# EAGLE design ESP-XBee_v1.0 (EAGLE 7.5.0)
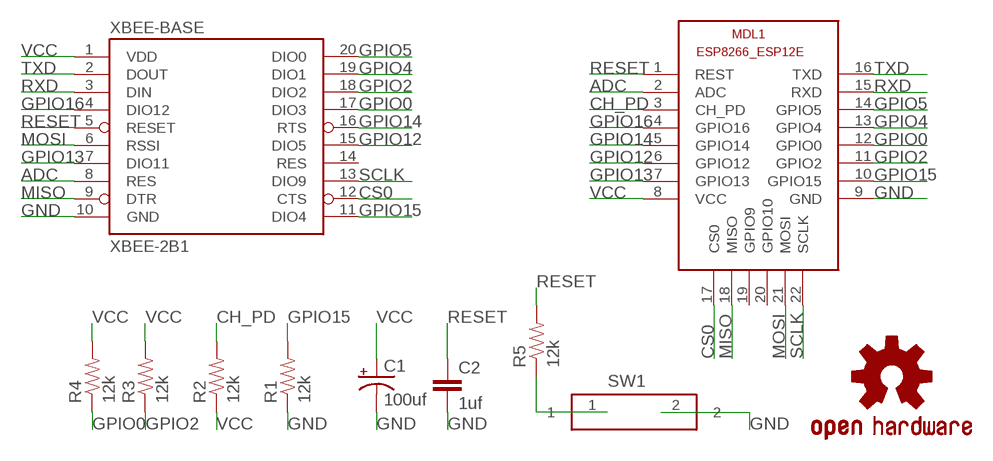
[diagram p0: schematic, sheet 1]

## Parts
C1  100uf  CAP_POL1206-KIT  [EIA3216-KIT]
C2  1uf  CAP0805  [0805]
LOGO3  OSHW-LOGOS  [OSHW-LOGO-S]
MDL1  ESP8266-12EESP8266-ESP12E  [ESP8266-ESP12E]
R1  12k  RESISTOR0805-RES  [0805]
R2  12k  RESISTOR0805-RES  [0805]
R3  12k  RESISTOR0805-RES  [0805]
R4  12k  RESISTOR0805-RES  [0805]
R5  12k  RESISTOR0805-RES  [0805]
SW1  434111043826  [434111043826]
XBEE-BASE  XBEE-2B1  [XBEE-1]

## Nets
ADC: MDL1.2(ADC) XBEE-BASE.8(RES)
CH_PD: MDL1.3(CH_PD) R2.2
CS0: MDL1.17(CS0) XBEE-BASE.12(CTS)
GND: C1.C(-) C2.2 MDL1.9(GND) R1.1 SW1.2 XBEE-BASE.10(GND)
GPIO0: MDL1.12(GPIO0) R4.1 XBEE-BASE.17(DIO3)
GPIO2: MDL1.11(GPIO2) R3.1 XBEE-BASE.18(DIO2)
GPIO4: MDL1.13(GPIO4) XBEE-BASE.19(DIO1)
GPIO5: MDL1.14(GPIO5) XBEE-BASE.20(DIO0)
GPIO12: MDL1.6(GPIO12) XBEE-BASE.15(DIO5)
GPIO13: MDL1.7(GPIO13) XBEE-BASE.7(DIO11)
GPIO14: MDL1.5(GPIO14) XBEE-BASE.16(RTS)
GPIO15: MDL1.10(GPIO15) R1.2 XBEE-BASE.11(DIO4)
GPIO16: MDL1.4(GPIO16) XBEE-BASE.4(DIO12)
MISO: MDL1.18(MISO) XBEE-BASE.9(DTR)
MOSI: MDL1.21(MOSI) XBEE-BASE.6(RSSI)
N$1: R5.1 SW1.1
RESET: C2.1 MDL1.1(REST) R5.2 XBEE-BASE.5(RESET)
RXD: MDL1.15(RXD) XBEE-BASE.3(DIN)
SCLK: MDL1.22(SCLK) XBEE-BASE.13(DIO9)
TXD: MDL1.16(TXD) XBEE-BASE.2(DOUT)
VCC: C1.A(+) MDL1.8(VCC) R2.1 R3.2 R4.2 XBEE-BASE.1(VDD)
Unconnected: MDL1.19(GPIO9) MDL1.20(GPIO10) XBEE-BASE.14(RES)

## Library data of the parts
C1 = SparkFun-Capacitors:CAP_POL: Capacitor Polarized These are standard SMD and PTH capacitors. Normally 10uF, 47uF, and 100uF in electrolytic and tantalum varieties. Always verify the external diameter of the through hole cap, it varies with capacity, voltage, and manufacturer. The EIA devices should be standard.
C2 = SparkFun-Capacitors:CAP: Capacitor Standard 0603 ceramic capacitor, and 0.1" leaded capacitor.
LOGO3 = SparkFun-Aesthetics:OSHW-LOGO: Open Source Hardware Logo This logo indicates the piece of hardware it is found on incorporates a OSHW license and/or adheres to the definition of open source hardware found here: http://freedomdefined.org/OSHW
MDL1 = ESP8266-ESP12E:ESP8266-12E: ESP8266-12E with additional I/O and GPIO04/05 corrected The author cannot warrant that this library is free from error or will meet your specific requirements. Created by PuceBaboon.com. Komagane, Nagano, JAPAN
R1-R5 = SparkFun-Passives:RESISTOR: Resistor Basic schematic elements and footprints for 0603, 1206, and PTH resistors.
SW1 = Switches_rev16a:434111043826: WS-TRS-6x3.5 mm SMD Tact Switch, 2 pins
XBEE-BASE = SparkFun-RF:XBEE-2: Xbee module footprints SMT header is CONN-09042.

## Board
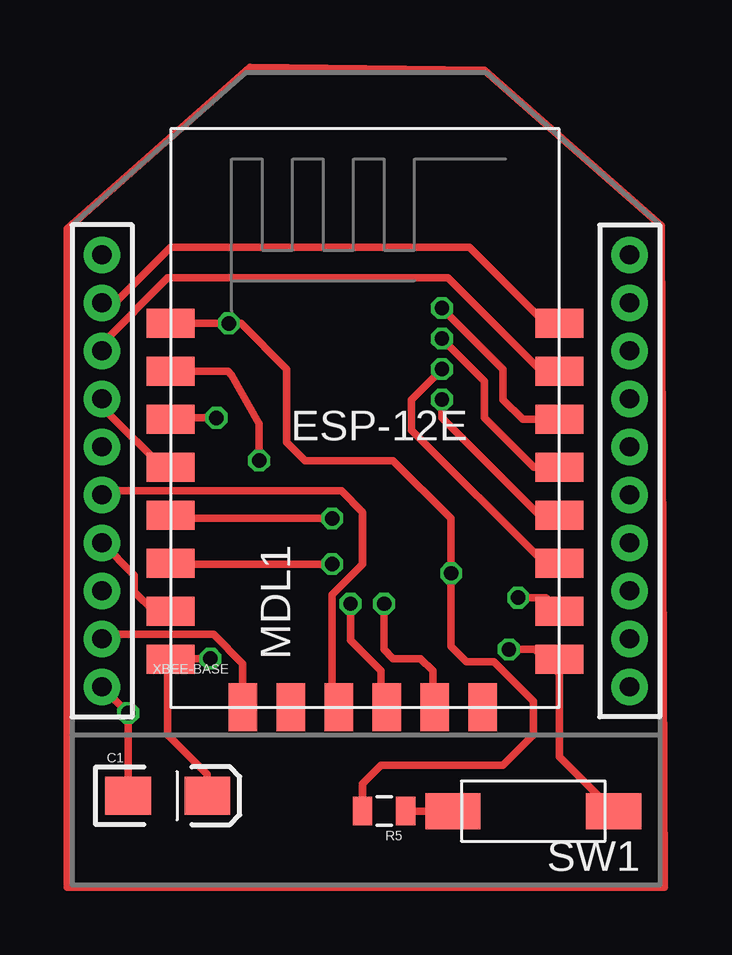
[diagram p1: board, top side]
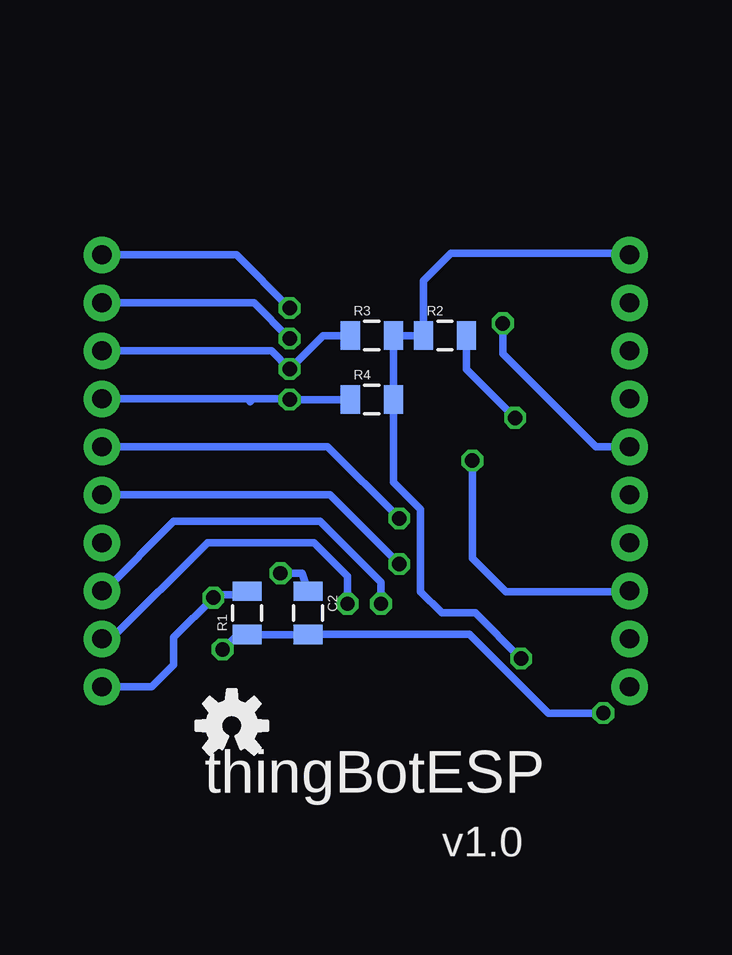
[diagram p2: board, bottom side, seen from below]

No outline drawn. Coordinates in mm, seen from the top.
Copper layers (1*16): Top 0.035mm / dielectric 1.5mm / Bottom 0.035mm
Design rules "SeeedStudio_2layer_DRU_no_angle_20140221": minimum track width 6mil, minimum drill 12mil, track to track 6mil, track to pad 6mil, pad to pad 6mil, via to via 6mil, smd to smd 0mil, copper to edge 10mil, drill to drill 10mil, minimum pad ring 10mil, minimum via ring 6mil, stop-mask expansion 2mil, vias tented up to drill 100mil, thermal gap 10mil

### Footprints (pad centres in the part's own frame; a part is rotated, then mirrored left to right if it is on the bottom)
EIA3216-KIT = smd 1.9 x 1.6: A 1.65,0; C -1.65,0
0805 = smd 0.8 x 1.2: 1 -0.9,0; 2 0.9,0
ESP8266-ESP12E = smd 2 x 1.2: 1 0,16; 2 0,14; 3 0,12; 4 0,10; 5 0,8; 6 0,6; 7 0,4; 8 0,2; 9 16.2,2; 10 16.2,4; 11 16.2,6; 12 16.2,8; 13 16.2,10; 14 16.2,12; 15 16.2,14; 16 16.2,16 | smd 1.2 x 2: 17 11,0; 18 3,0; 19 5,0; 20 13,0; 21 7,0; 22 9,0
434111043826 = smd 2.3 x 1.5: 1 -3.35,0; 2 3.35,0
XBEE-1 = drill 0.8 pad 1.524: 1 -11,20; 2 -11,18; 3 -11,16; 4 -11,14; 5 -11,12; 6 -11,10; 7 -11,8; 8 -11,6; 9 -11,4; 10 -11,2; 11 11,2; 12 11,4; 13 11,6; 14 11,8; 15 11,10; 16 11,12; 17 11,14; 18 11,16; 19 11,18; 20 11,20

### Placement (x,y rotation side)
C1  34.29,22.86 0 top
C2  44.96,30.48 270 bottom
LOGO3  48.13,25.78 0 bottom
MDL1  34.42,26.54 0 top
R1  47.5,30.48 90 bottom
R2  39.24,42.04 0 bottom
R3  42.29,42.04 0 bottom
R4  42.29,39.37 0 bottom
R5  43.31,22.23 180 top
SW1  49.53,22.23 0 top
XBEE-BASE  42.55,25.4 0 top

### Tracks (layer width: path | path; a pad name or v marks a point on that pad's centre or on a via)
ADC  (via drill 0.6)
  Top 0.305: MDL1.2 36.8,40.54 36.96,40.39 38.1,38.35 v38.1,36.83
  Bottom 0.305: v38.1,36.83 38.1,32.77 36.7,31.37 31.58,31.37 XBEE-BASE.8
CH_PD  (via drill 0.6)
  Top 0.305: v36.32,38.61 34.48,38.61 MDL1.3
  Bottom 0.305: R2.2 38.34,40.63 v36.32,38.61
CS0  (via drill 0.6)
  Top 0.305: v43.31,30.86 43.31,28.96 43.69,28.57 44.83,28.57 45.34,28.07 45.34,26.62 MDL1.17
  Bottom 0.305: XBEE-BASE.12 53.15,29.4 49.15,33.4 44.7,33.4 43.31,32 v43.31,30.86
GND  (via drill 0.6)
  Top 0.305: MDL1.9 50.62,27.94 | 50.62,27.94 50.62,24.49 SW1.2 | C1.C v32.64,26.3 XBEE-BASE.10 | v48.51,28.96 49.6,28.96 50.62,27.94
  Bottom 0.305: v32.64,26.3 34.94,26.3 38.23,29.59 44.44,29.59 C2.2 R1.1 47.89,29.58 v48.51,28.96
GPIO0  (via drill 0.6)
  Top 0.305: MDL1.12 49.78,34.54 45.72,38.61 v45.72,39.37
  Bottom 0.305: XBEE-BASE.17 47.24,39.4 | 47.24,39.4 45.75,39.4 v45.72,39.37 R4.1 | 47.37,39.27 47.24,39.4
GPIO2  (via drill 0.6)
  Top 0.305: MDL1.11 50.01,32.54 44.45,38.1 44.45,39.37 v45.72,40.64
  Bottom 0.305: XBEE-BASE.18 46.48,41.4 v45.72,40.64 44.32,42.04 R3.1
GPIO4  (via drill 0.6)
  Top 0.305: MDL1.13 49.56,36.54 47.5,38.61 47.5,40.13 v45.72,41.91
  Bottom 0.305: XBEE-BASE.19 47.21,43.4 v45.72,41.91
GPIO5  (via drill 0.6)
  Top 0.305: MDL1.14 49.09,38.54 48.26,39.37 48.26,40.64 v45.72,43.18
  Bottom 0.305: XBEE-BASE.20 47.94,45.4 v45.72,43.18
GPIO12  (via drill 0.6)
  Top 0.305: v41.15,32.51 34.45,32.51 MDL1.6
  Bottom 0.305: XBEE-BASE.15 44.04,35.4 v41.15,32.51
GPIO13
  Top 0.305: MDL1.7 33.72,30.54 32.89,31.37 32.89,32.05 XBEE-BASE.7
GPIO14  (via drill 0.6)
  Top 0.305: v41.15,34.42 34.54,34.42 MDL1.5
  Bottom 0.305: XBEE-BASE.16 44.13,37.4 v41.15,34.42
GPIO15  (via drill 0.6)
  Top 0.305: v48.9,31.11 50.05,31.11 MDL1.10
  Bottom 0.305: R1.2 47.64,31.24 48.77,31.24 v48.9,31.11 50.55,29.46 50.55,28.32 51.47,27.4 XBEE-BASE.11
GPIO16
  Top 0.305: MDL1.4 34.07,36.54 31.88,38.73 31.88,39.07 XBEE-BASE.4
MISO
  Top 0.305: MDL1.18 37.42,28.37 36.2,29.59 31.74,29.59 XBEE-BASE.9
MOSI
  Top 0.305: XBEE-BASE.6 31.59,35.4 31.75,35.56 41.53,35.56 42.42,34.67 42.42,32.51 41.15,31.24 41.15,26.81 MDL1.21
N$1
  Top 0.305: SW1.1 R5.1
N$2
  Top 0.305: 30.1,19.18 30.1,46.48 37.72,53.21 47.5,53.09 54.86,46.61 54.99,19.05 30.61,19.05 30.48,19.05 30.1,19.05
RESET  (via drill 0.6)
  Top 0.305: R5.2 42.41,23.36 43.18,24.13 48.26,24.13 49.53,25.4 49.53,26.8 47.88,28.45 46.74,28.45 46.1,29.08 v46.1,32.13 46.1,34.42 43.69,36.83 40.01,36.83 39.24,37.59 39.24,40.64 37.34,42.55 v36.83,42.55 MDL1.1 34.54,42.42
  Bottom 0.305: v46.1,32.13 45.2,32.13 C2.1 | XBEE-BASE.5 32.95,37.4 36.83,41.27 v36.83,42.55
RXD
  Top 0.305: XBEE-BASE.3 31.55,41.7 34.29,44.45 45.97,44.45 49.91,40.51 50.59,40.51 MDL1.15
SCLK  (via drill 0.6)
  Top 0.305: MDL1.22 43.18,26.78 43.18,28.07 41.91,29.34 v41.91,30.86
  Bottom 0.305: XBEE-BASE.13 53.44,31.4 50.55,34.29 44.45,34.29 41.91,31.75 v41.91,30.86
TXD
  Top 0.305: XBEE-BASE.2 32.1,43.4 34.42,45.72 46.86,45.72 50.04,42.55 MDL1.16
VCC  (via drill 0.6)
  Top 0.305: C1.A 35.94,23.75 34.29,25.4 34.29,28.42 MDL1.8 34.45,28.57 v36.07,28.57
  Bottom 0.305: XBEE-BASE.1 31.61,45.47 38.99,45.47 40.14,44.31 R2.1 R3.2 R4.2 41.39,35.93 40.26,34.8 40.26,31.37 39.37,30.48 37.97,30.48 v36.07,28.57

### Text on the board
bNames: thingBotESP | v1.0